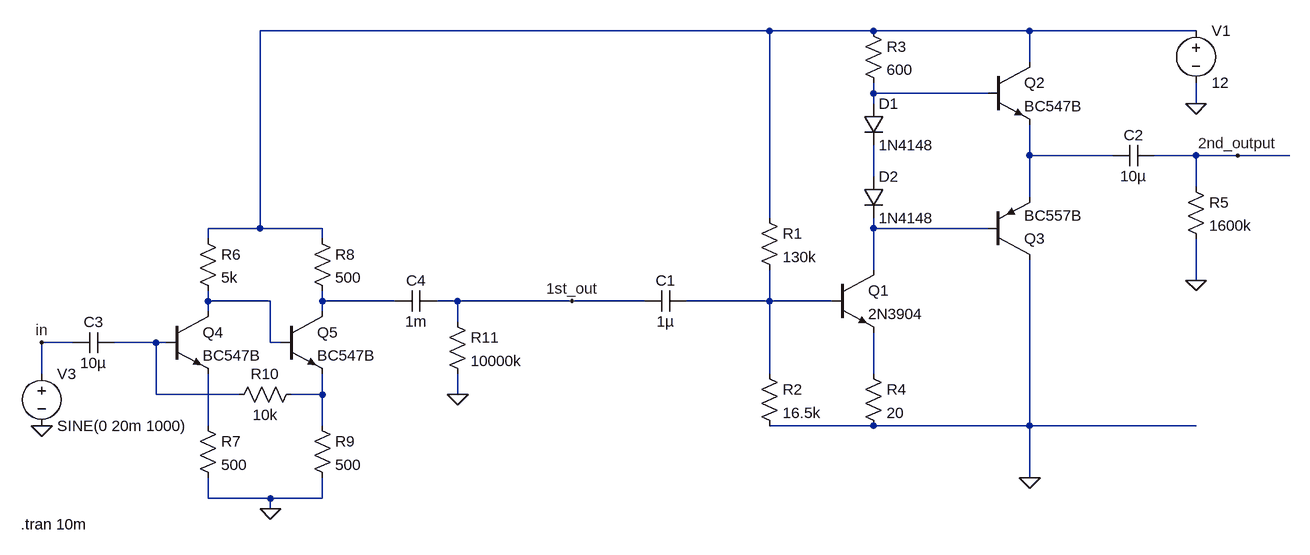
[diagram p0: schematic power_amplifier(2stages).asc]
power_amplifier(2stages).asc, the LTspice schematic file:
Version 4
SHEET 1 1072 680
WIRE 144 -320 -640 -320
WIRE 304 -320 144 -320
WIRE 544 -320 304 -320
WIRE 800 -320 544 -320
WIRE 544 -272 544 -320
WIRE 304 -224 304 -240
WIRE 480 -224 304 -224
WIRE 304 -208 304 -224
WIRE 800 -208 800 -240
WIRE 544 -128 544 -176
WIRE 672 -128 544 -128
WIRE 800 -128 736 -128
WIRE 864 -128 800 -128
WIRE 944 -128 864 -128
WIRE 304 -96 304 -144
WIRE 800 -80 800 -128
WIRE 544 -64 544 -128
WIRE 144 -32 144 -320
WIRE -640 -16 -640 -320
WIRE -640 -16 -720 -16
WIRE -544 -16 -640 -16
WIRE 304 -16 304 -32
WIRE 480 -16 304 -16
WIRE -720 0 -720 -16
WIRE -544 0 -544 -16
WIRE 304 48 304 -16
WIRE 800 64 800 0
WIRE -720 96 -720 80
WIRE -624 96 -720 96
WIRE -544 96 -544 80
WIRE -432 96 -544 96
WIRE -336 96 -368 96
WIRE -160 96 -336 96
WIRE -48 96 -160 96
WIRE 144 96 144 48
WIRE 144 96 16 96
WIRE 240 96 144 96
WIRE -720 112 -720 96
WIRE -544 112 -544 96
WIRE -336 128 -336 96
WIRE -928 160 -976 160
WIRE -800 160 -864 160
WIRE -784 160 -800 160
WIRE -624 160 -624 96
WIRE -608 160 -624 160
WIRE -976 208 -976 160
WIRE 144 208 144 96
WIRE 304 208 304 144
WIRE -800 240 -800 160
WIRE -672 240 -800 240
WIRE -544 240 -544 208
WIRE -544 240 -592 240
WIRE -336 240 -336 208
WIRE -720 288 -720 208
WIRE -544 288 -544 240
WIRE 304 288 144 288
WIRE 544 288 544 32
WIRE 544 288 304 288
WIRE 800 288 544 288
WIRE 544 368 544 288
WIRE -720 400 -720 368
WIRE -624 400 -720 400
WIRE -544 400 -544 368
WIRE -544 400 -624 400
WIRE -624 416 -624 400
FLAG 544 368 0
FLAG 800 64 0
FLAG 864 -128 2nd_output
FLAG 800 -208 0
FLAG -624 416 0
FLAG -976 288 0
FLAG -336 240 0
FLAG -976 160 in
FLAG -160 96 1st_out
SYMBOL res 128 192 R0
SYMATTR InstName R2
SYMATTR Value 16.5k
SYMBOL res 288 -336 R0
SYMATTR InstName R3
SYMATTR Value 600
SYMBOL res 288 192 R0
SYMATTR InstName R4
SYMATTR Value 20
SYMBOL cap 16 80 R90
WINDOW 0 0 32 VBottom 2
WINDOW 3 32 32 VTop 2
SYMATTR InstName C1
SYMATTR Value 1µ
SYMBOL npn 240 48 R0
SYMATTR InstName Q1
SYMATTR Value 2N3904
SYMBOL diode 288 -208 R0
SYMATTR InstName D1
SYMATTR Value 1N4148
SYMBOL diode 288 -96 R0
SYMATTR InstName D2
SYMATTR Value 1N4148
SYMBOL npn 480 -272 R0
SYMATTR InstName Q2
SYMATTR Value BC547B
SYMBOL pnp 480 32 M180
SYMATTR InstName Q3
SYMATTR Value BC557B
SYMBOL cap 736 -144 R90
WINDOW 0 0 32 VBottom 2
WINDOW 3 32 32 VTop 2
SYMATTR InstName C2
SYMATTR Value 10µ
SYMBOL res 784 -96 R0
SYMATTR InstName R5
SYMATTR Value 1600k
SYMBOL voltage 800 -336 R0
WINDOW 123 0 0 Left 0
WINDOW 39 0 0 Left 0
SYMATTR InstName V1
SYMATTR Value 12
SYMBOL res 128 -48 R0
SYMATTR InstName R1
SYMATTR Value 130k
SYMBOL res -736 -16 R0
SYMATTR InstName R6
SYMATTR Value 5k
SYMBOL res -736 272 R0
SYMATTR InstName R7
SYMATTR Value 500
SYMBOL res -560 -16 R0
SYMATTR InstName R8
SYMATTR Value 500
SYMBOL res -560 272 R0
SYMATTR InstName R9
SYMATTR Value 500
SYMBOL res -576 224 R90
WINDOW 0 0 56 VBottom 2
WINDOW 3 32 56 VTop 2
SYMATTR InstName R10
SYMATTR Value 10k
SYMBOL cap -864 144 R90
WINDOW 0 0 32 VBottom 2
WINDOW 3 32 32 VTop 2
SYMATTR InstName C3
SYMATTR Value 10µ
SYMBOL cap -368 80 R90
WINDOW 0 0 32 VBottom 2
WINDOW 3 32 32 VTop 2
SYMATTR InstName C4
SYMATTR Value 1m
SYMBOL npn -784 112 R0
SYMATTR InstName Q4
SYMATTR Value BC547B
SYMBOL npn -608 112 R0
SYMATTR InstName Q5
SYMATTR Value BC547B
SYMBOL voltage -976 192 R0
WINDOW 123 0 0 Left 0
WINDOW 39 0 0 Left 0
SYMATTR InstName V3
SYMATTR Value SINE(0 20m 1000)
SYMBOL res -352 112 R0
SYMATTR InstName R11
SYMATTR Value 10000k
TEXT -1008 440 Left 2 !.tran 10m

The netlist it stands for:
* power_amplifier(2stages).asc
R2 N008 0 16.5k
R3 N001 N002 600
R4 N010 0 20
C1 N008 1st_out 1µ
Q1 N005 N008 N010 0 2N3904
D1 N002 N004 1N4148
D2 N004 N005 1N4148
Q2 N001 N002 N003 0 BC547B
Q3 0 N005 N003 0 BC557B
C2 2nd_output N003 10µ
R5 2nd_output 0 1600k
V1 N001 0 12
R1 N001 N008 130k
R6 N001 N006 5k
R7 N012 0 500
R8 N001 N007 500
R9 N011 0 500
R10 N011 N009 10k
C3 N009 in 10µ
C4 1st_out N007 1m
Q4 N006 N009 N012 0 BC547B
Q5 N007 N006 N011 0 BC547B
V3 in 0 SINE(0 20m 1000)
R11 1st_out 0 10000k
.model D D
.lib standard.dio
.model NPN NPN
.model PNP PNP
.lib standard.bjt
.tran 10m
.backanno
.end